# EAGLE schematic power electronics7 (EAGLE 9.2.2)
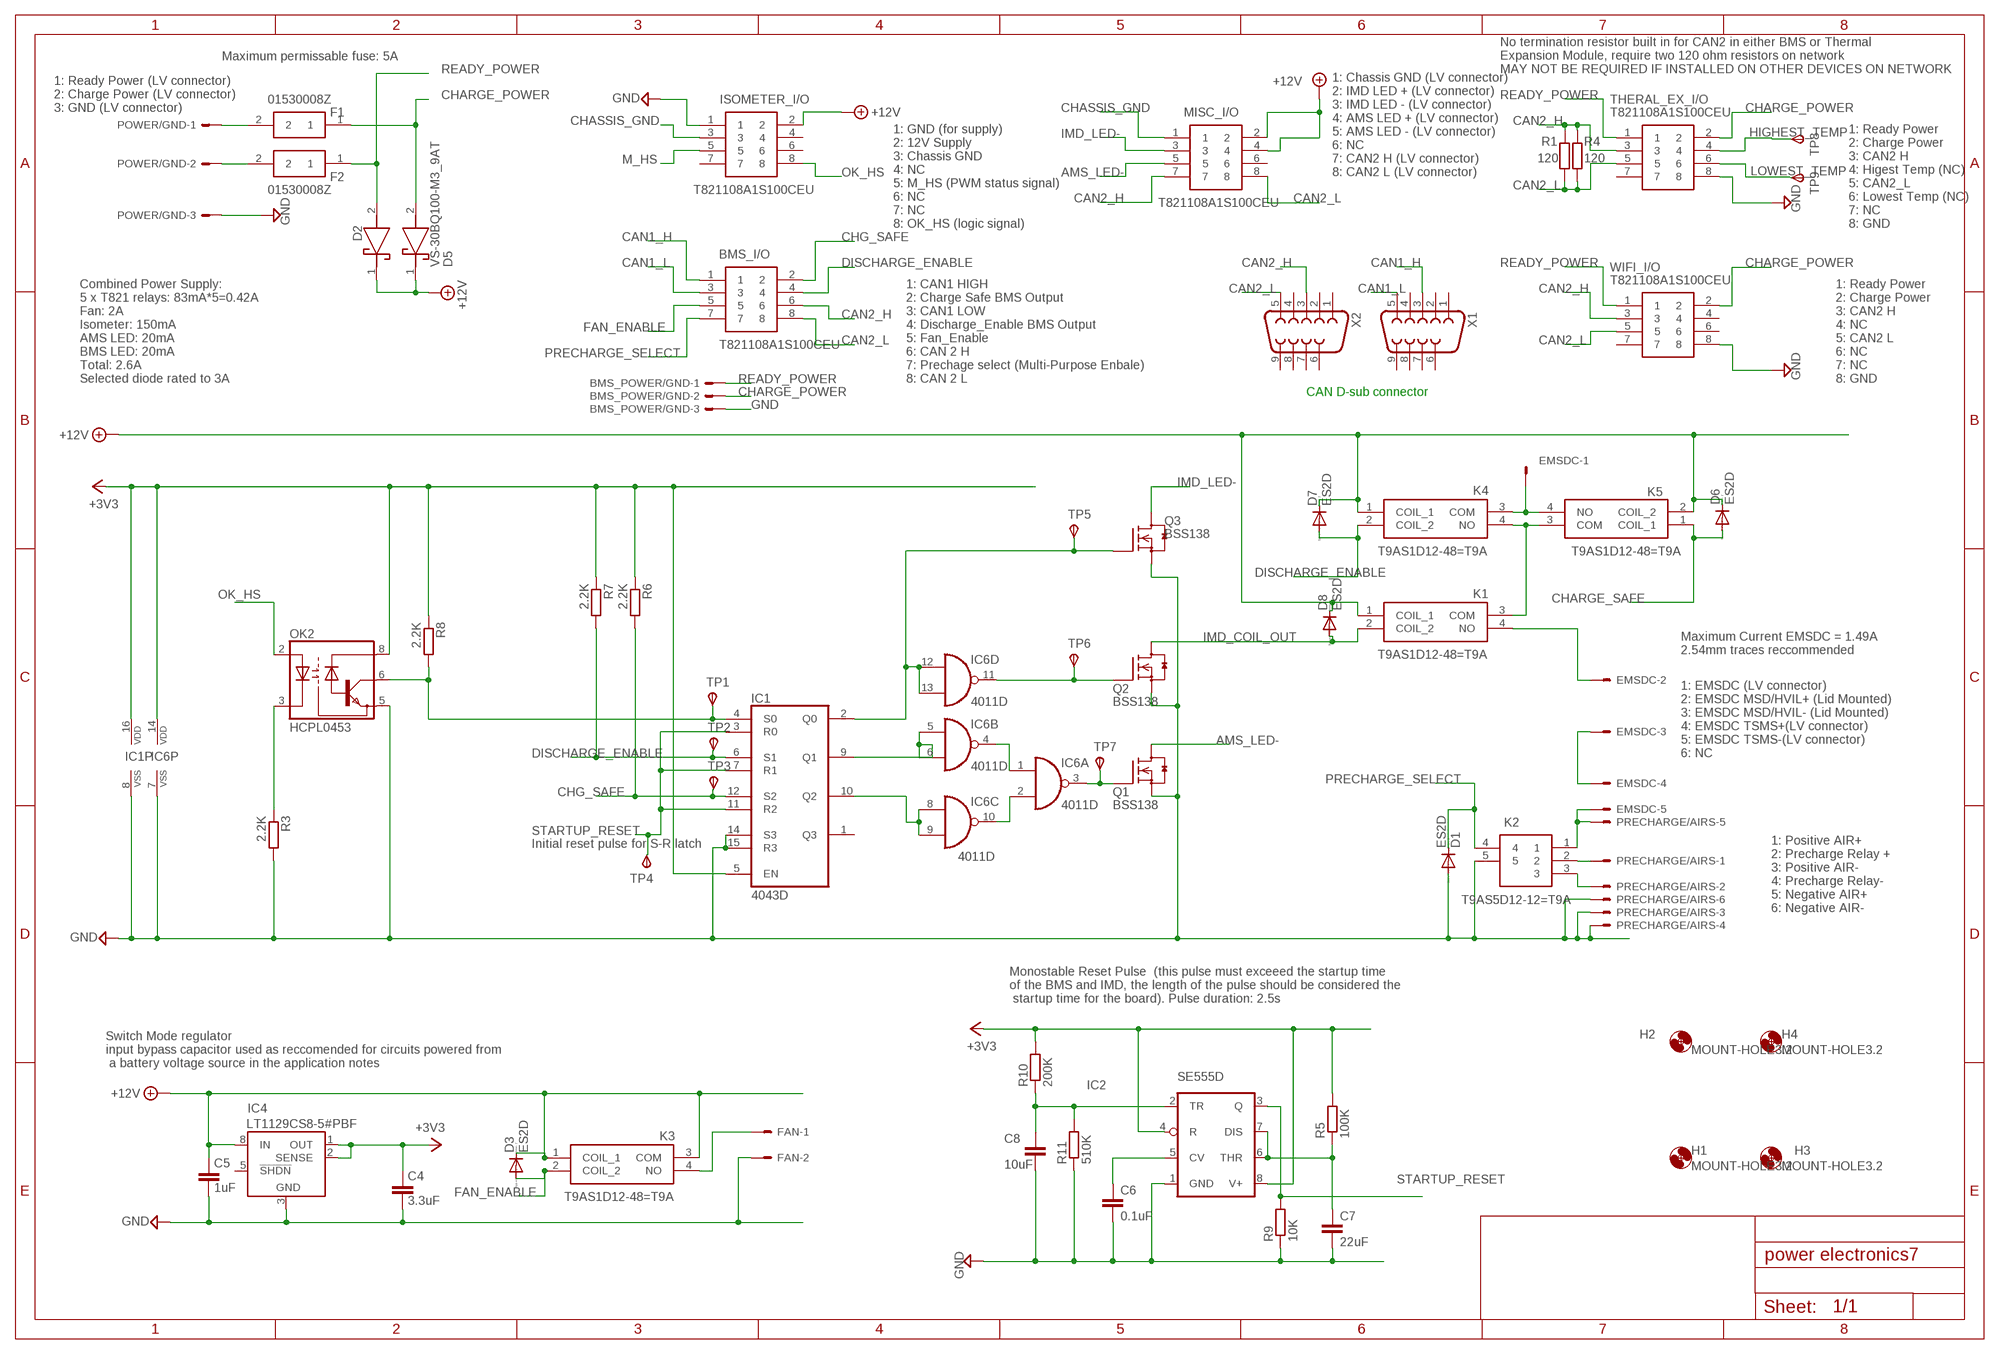
[diagram p0: schematic, sheet 1]

## Parts
BMS_I/O  T821108A1S100CEU  [HDRV8W64P254_2X4_1778X895X915P]
BMS_POWER/GND  KK-156-3  [KK-156-3]
C4  3.3uF  C-EUC1206  [C1206]
C5  1uF  C-EUC1206  [C1206]
C6  0.1uF  C-EUC1206  [C1206]
C7  22uF  C-EUC1206  [C1206]
C8  10uF  C-EUC1206  [C1206]
D1  ES2D  [SMB]
D2  VS-30BQ100-M3_9AT  [DIOM7959X262N]
D3  ES2D  [SMB]
D5  VS-30BQ100-M3_9AT  [DIOM7959X262N]
D6  ES2D  [SMB]
D7  ES2D  [SMB]
D8  ES2D  [SMB]
EMSDC  KK-156-6  [KK-156-6]
F1  01530008Z  [01530008]
F2  01530008Z  [01530008]
FAN  KK-156-2  [KK-156-2]
H1  MOUNT-HOLE3.2  [3,2]
H2  MOUNT-HOLE3.2  [3,2]
H3  MOUNT-HOLE3.2  [3,2]
H4  MOUNT-HOLE3.2  [3,2]
IC1  4043D  [SO16]
IC2  SE555D  [SO08]
IC4  LT1129CS8  [SOIC8]
IC6  4011D  [SO14]
ISOMETER_I/O  T821108A1S100CEU  [HDRV8W64P254_2X4_1778X895X915P]
K1  T9AS1D12-48=T9A  [T9AS1D1248T9A]
K2  T9AS5D12-12=T9A  [T9AS1D12]
K3  T9AS1D12-48=T9A  [T9AS1D1248T9A]
K4  T9AS1D12-48=T9A  [T9AS1D1248T9A]
K5  T9AS1D12-48=T9A  [T9AS1D1248T9A]
MISC_I/O  T821108A1S100CEU  [HDRV8W64P254_2X4_1778X895X915P]
OK2  HCPL0453  [SOIC08]
POWER/GND  KK-156-3  [KK-156-3]
PRECHARGE/AIRS  KK-156-6  [KK-156-6]
Q1  BSS138  [SOT23]
Q2  BSS138  [SOT23]
Q3  BSS138  [SOT23]
R1  120  R-EU_R1206  [R1206]
R3  2.2K  R-EU_R1206  [R1206]
R4  120  R-EU_R1206  [R1206]
R5  100K  R-EU_R1206  [R1206]
R6  2.2K  R-EU_R1206  [R1206]
R7  2.2K  R-EU_R1206  [R1206]
R8  2.2K  R-EU_R1206  [R1206]
R9  10K  R-EU_R1206  [R1206]
R10  200K  R-EU_R1206  [R1206]
R11  510K  R-EU_R1206  [R1206]
THERAL_EX_I/O  T821108A1S100CEU  [HDRV8W64P254_2X4_1778X895X915P]
TP1  TPSTP11R  [TP11R]
TP2  TPSTP11R  [TP11R]
TP3  TPSTP11R  [TP11R]
TP4  TPSTP11R  [TP11R]
TP5  TPSTP11R  [TP11R]
TP6  TPSTP11R  [TP11R]
TP7  TPSTP11R  [TP11R]
TP8  TPSTP11R  [TP11R]
TP9  TPSTP11R  [TP11R]
WIFI_I/O  T821108A1S100CEU  [HDRV8W64P254_2X4_1778X895X915P]
X1  F09V  [F09V]
X2  F09V  [F09V]

## Nets
+3V3: C4.1 IC1.5(EN) IC1.16(VDD) IC2.4(R) IC2.8(V+) IC4.1(OUT) IC4.2(SENSE) IC6.14(P:VDD) OK2.8(VCC) R5.2 R6.1 R7.1 R8.1 R10.2
+12V [power]: C5.1 D2.1(K) D3.C D5.1(K) D6.C D7.C D8.C IC4.8(IN) ISOMETER_I/O.2 K1.1(COIL_1) K3.1(COIL_1) K3.3(COM) K4.1(COIL_1) K5.2(COIL_2) MISC_I/O.2 MISC_I/O.4
AMS_LED-: MISC_I/O.5 Q1.3(D)
CAN1_H: BMS_I/O.1 X1.3
CAN1_L: BMS_I/O.3 X1.5
CAN2_H: BMS_I/O.6 MISC_I/O.7 R1.1 R4.1 THERAL_EX_I/O.3 WIFI_I/O.3 X2.3
CAN2_L: BMS_I/O.8 MISC_I/O.8 R1.2 R4.2 THERAL_EX_I/O.5 WIFI_I/O.5 X2.5
CHARGE_POWER [power]: BMS_POWER/GND.2 D5.2(A) F1.1 THERAL_EX_I/O.2 WIFI_I/O.2
CHARGE_SAFE: D6.A K5.1(COIL_1)
CHASSIS_GND [GND]: ISOMETER_I/O.3 MISC_I/O.1
CHG_SAFE: BMS_I/O.2 IC1.12(S2) R6.2 TP3.TP(PP)
DISCHARGE_ENABLE: BMS_I/O.4 D7.A IC1.6(S1) K4.2(COIL_2) R7.2 TP2.TP(PP)
EMSDC_IMD+ [EMSDC]: K1.3(COM) K4.4(NO) K5.3(COM)
FAN+ [power]: FAN.1 K3.4(NO)
FAN_ENABLE: BMS_I/O.5 D3.A K3.2(COIL_2)
GND [GND]: BMS_POWER/GND.3 C4.2 C5.2 C6.2 C7.2 C8.2 D1.A FAN.2 IC1.8(VSS) IC1.14(S3) IC1.15(R3) IC2.1(GND) IC4.3(GND) IC6.7(P:VSS) ISOMETER_I/O.1 K2.5 OK2.5(GND) POWER/GND.3 PRECHARGE/AIRS.3 PRECHARGE/AIRS.4 PRECHARGE/AIRS.6 Q1.2(S) Q2.2(S) Q3.2(S) R3.2 R9.1 R11.1 THERAL_EX_I/O.8 WIFI_I/O.8
HIGHEST_TEMP: THERAL_EX_I/O.4 TP8.TP(PP)
IMD_COIL_OUT: D8.A K1.2(COIL_2) Q2.3(D)
IMD_LED-: MISC_I/O.3 Q3.3(D)
LOWEST_TEMP: THERAL_EX_I/O.6 TP9.TP(PP)
M_HS: ISOMETER_I/O.5
N$1 [EMSDC]: EMSDC.1 K4.3(COM) K5.4(NO)
N$2 [power]: F2.2 POWER/GND.2
N$3 [EMSDC]: K2.2 PRECHARGE/AIRS.1
N$4 [power]: F1.2 POWER/GND.1
N$5: IC1.4(S0) OK2.6(VO) R8.2 TP1.TP(PP)
N$7: OK2.3(C) R3.1
N$8: IC1.2(Q0) IC6.12(D:I0) IC6.13(D:I1) Q3.1(G) TP5.TP(PP)
N$10: IC1.9(Q1) IC6.5(B:I0) IC6.6(B:I1)
N$11 [EMSDC]: EMSDC.5 K2.1 PRECHARGE/AIRS.5
N$12 [EMSDC]: K2.3 PRECHARGE/AIRS.2
N$13: IC1.10(Q2) IC6.8(C:I0) IC6.9(C:I1)
N$14: IC6.1(A:I0) IC6.4(B:O)
N$15 [EMSDC]: EMSDC.2 K1.4(NO)
N$17: C7.1 IC2.6(THR) IC2.7(DIS) R5.1
N$19 [EMSDC]: EMSDC.3 EMSDC.4
N$20: IC6.2(A:I1) IC6.10(C:O)
N$21: IC6.3(A:O) Q1.1(G) TP7.TP(PP)
N$28: C8.1 IC2.2(TR) R10.1 R11.2
N$32: C6.1 IC2.5(CV)
N$37: IC6.11(D:O) Q2.1(G) TP6.TP(PP)
OK_HS: ISOMETER_I/O.8 OK2.2(A)
PRECHARGE_SELECT: BMS_I/O.7 D1.C K2.4
READY_POWER [power]: BMS_POWER/GND.1 D2.2(A) F2.1 THERAL_EX_I/O.1 WIFI_I/O.1
STARTUP_RESET: IC1.3(R0) IC1.7(R1) IC1.11(R2) IC2.3(Q) R9.2 TP4.TP(PP)
Unconnected: EMSDC.6 IC1.1(Q3) IC4.4(NC) IC4.5(!SHDN) ISOMETER_I/O.4 ISOMETER_I/O.6 ISOMETER_I/O.7 MISC_I/O.6 THERAL_EX_I/O.7 WIFI_I/O.4 WIFI_I/O.6 WIFI_I/O.7 X1.1 X1.2 X1.4 X1.6 X1.7 X1.8 X1.9 X2.1 X2.2 X2.4 X2.6 X2.7 X2.8 X2.9

## Notes on the sheet
- Maximum permissable fuse: 5A
- No termination resistor built in for CAN2 in either BMS or Thermal
  Expansion Module, require two 120 ohm resistors on network
  MAY NOT BE REQUIRED IF INSTALLED ON OTHER DEVICES ON NETWORK
- 1: Ready Power (LV connector)
  2: Charge Power (LV connector)
  3: GND (LV connector)
- 1: Chassis GND (LV connector)
  2: IMD LED + (LV connector)
  3: IMD LED - (LV connector)
  4: AMS LED + (LV connector)
  5: AMS LED - (LV connector)
  6: NC
  7: CAN2 H (LV connector)
  8: CAN2 L (LV connector)
- 1: GND (for supply) 
  2: 12V Supply
  3: Chassis GND 
  4: NC 
  5: M_HS (PWM status signal)
  6: NC
  7: NC
  8: OK_HS (logic signal)
- 1: Ready Power
  2: Charge Power
  3: CAN2 H
  4: Higest Temp (NC)
  5: CAN2_L
  6: Lowest Temp (NC)
  7: NC
  8: GND
- Combined Power Supply:
  5 x T821 relays: 83mA*5=0.42A
  Fan: 2A
  Isometer: 150mA
  AMS LED: 20mA
  BMS LED: 20mA
  Total: 2.6A
  Selected diode rated to 3A
- 1: CAN1 HIGH
  2: Charge Safe BMS Output 
  3: CAN1 LOW
  4: Discharge_Enable BMS Output
  5: Fan_Enable
  6: CAN 2 H
  7: Prechage select (Multi-Purpose Enbale)
  8: CAN 2 L
- 1: Ready Power
  2: Charge Power
  3: CAN2 H
  4: NC
  5: CAN2 L
  6: NC
  7: NC
  8: GND
- CAN D-sub connector
- Maximum Current EMSDC = 1.49A
  2.54mm traces reccommended
- 1: EMSDC (LV connector)
  2: EMSDC MSD/HVIL+ (Lid Mounted)
  3: EMSDC MSD/HVIL- (Lid Mounted)
  4: EMSDC TSMS+(LV connector)
  5: EMSDC TSMS-(LV connector)
  6: NC
- Initial reset pulse for S-R latch
- 1: Positive AIR+
  2: Precharge Relay +
  3: Positive AIR-
  4: Precharge Relay-
  5: Negative AIR+
  6: Negative AIR-
- Monostable Reset Pulse  (this pulse must exceeed the startup time 
  of the BMS and IMD, the length of the pulse should be considered the
   startup time for the board). Pulse duration: 2.5s
- Switch Mode regulator
  input bypass capacitor used as reccomended for circuits powered from
   a battery voltage source in the application notes

## Power pins joined to a net without a drawn wire
GND: IC4.6(GND) IC4.7(GND)

## Library data of the parts
BMS_I/O ISOMETER_I/O MISC_I/O THERAL_EX_I/O WIFI_I/O = SamacSys_Parts:T821108A1S100CEU: HEADER, VERTICAL, 2.54MM, 8WAY Amphenol T821 Series, 2.54mm Pitch 8 Way 2 Row Straight PCB Header, Solder Termination, 3A Source: Datasheet <http://uk.rs-online.com/web/p/products/8323569>; DESCRIPTION: HEADER, VERTICAL, 2.54MM, 8WAY Amphenol T821 Series, 2.54mm Pitch 8 Way 2 Row Straight PCB Header, Solder Termination, 3A; HEIGHT: 9.15mm; MANUFACTURER_NAME: Amphenol; MANUFACTURER_PART_NUMBER: T821108A1S100CEU; RS_PART_NUMBER: 8323569; RS_PRICE-STOCK: http://uk.rs-online.com/web/p/products/8323569
BMS_POWER/GND POWER/GND = con-molex:KK-156-3: KK 156 HEADER Source: http://www.molex.com/pdm_docs/sd/026604100_sd.pdf; MF: MOLEX; OC_FARNELL: unknown; OC_NEWARK: unknown
C4-C8 = rcl:C-EU: CAPACITOR, European symbol; SPICEPREFIX: C
D1 D3 D6-D8 = diode:ES2D: DIODE super fast rectifier, 2 A
D2 D5 = SamacSys_Parts:VS-30BQ100-M3_9AT: Vishay VS-30BQ100-M3/9AT SMT Schottky Diode, 100V 3A, 2-Pin DO-214AB Source: Datasheet <https://componentsearchengine.com/Datasheets/1/VS-30BQ100-M3_9AT.pdf>; DESCRIPTION: Vishay VS-30BQ100-M3/9AT SMT Schottky Diode, 100V 3A, 2-Pin DO-214AB; HEIGHT: 2.62mm; MANUFACTURER_NAME: Vishay; MANUFACTURER_PART_NUMBER: VS-30BQ100-M3/9AT; MOUSER_PART_NUMBER: 78-VS-30BQ100-M39AT; MOUSER_PRICE-STOCK: https://www.mouser.com/Search/Refine.aspx?Keyword=78-VS-30BQ100-M39AT
EMSDC PRECHARGE/AIRS = con-molex:KK-156-6: KK 156 HEADER Source: http://www.molex.com/pdm_docs/sd/026604100_sd.pdf; MF: MOLEX; OC_FARNELL: unknown; OC_NEWARK: unknown
F1 F2 = SamacSys_Parts:01530008Z: Mini fuseholder,15A 32V Littelfuse 15A PCB Mount Fuse Holder Automotive Fuse, 32 V Source: Datasheet <http://www.littelfuse.com/data/en/data_sheets/153_pcmount.pdf>; ALLIED_NUMBER: 70184304; DESCRIPTION: Mini fuseholder,15A 32V Littelfuse 15A PCB Mount Fuse Holder Automotive Fuse, 32 V; HEIGHT: mm; MANUFACTURER_NAME: LITTELFUSE; MANUFACTURER_PART_NUMBER: 01530008Z; RS_PART_NUMBER: 3607317; RS_PRICE-STOCK: https://uk.rs-online.com/web/p/products/3607317
FAN = con-molex:KK-156-2: KK 156 HEADER Source: http://www.molex.com/pdm_docs/sd/026604100_sd.pdf; MF: MOLEX; OC_FARNELL: unknown; OC_NEWARK: unknown
H1-H4 = holes:MOUNT-HOLE: MOUNTING HOLE with drill center marker
IC1 = 40xx:4043: Quad 3-state NOR R/S LATCH
IC2 = linear:*555: TIMER
IC4 = linear-technology:LT1129CS8: VOLTAGE REGULATOR with shutdown; MPN: LT1129CS8-5#PBF; OC_FARNELL: 1273576; OC_NEWARK: 57M2078
IC6 = 40xx:4011: Quad 2-input NAND
K1 K3-K5 = SamacSys_Parts:T9AS1D12-48=T9A: SPST-NO PCB Mount Non-Latching Relay Through Hole, 48V dc Source: Datasheet <http://uk.rs-online.com/web/p/products/6802534P>; DESCRIPTION: SPST-NO PCB Mount Non-Latching Relay Through Hole, 48V dc; HEIGHT: 20.4mm; MANUFACTURER_NAME: TE Connectivity; MANUFACTURER_PART_NUMBER: T9AS1D12-48=T9A; RS_PART_NUMBER: 6802534P; RS_PRICE-STOCK: http://uk.rs-online.com/web/p/products/6802534P
K2 = SamacSys_Parts:T9AS5D12-12=T9A: PCB Relay SPDT 30A 12Vdc,thru hole SPDT PCB Mount Non-Latching Relay Through Hole, 12V dc Source: Datasheet; ALLIED_NUMBER: R1111589; DESCRIPTION: PCB Relay SPDT 30A 12Vdc,thru hole SPDT PCB Mount Non-Latching Relay Through Hole, 12V dc; HEIGHT: mm; MANUFACTURER_NAME: TE Connectivity; MANUFACTURER_PART_NUMBER: T9AS5D12-12=T9A; RS_PART_NUMBER: 6802528; RS_PRICE-STOCK: https://uk.rs-online.com/web/p/products/6802528
OK2 = optocoupler:HCPL0453: HEWLETT PACKARD OPTO COUPLER; MF: AGILENT TECHNOLOGIES; MPN: HCPL-0453-000E; OC_FARNELL: 1505123; OC_NEWARK: 88H7766
Q1-Q3 = m-pad-2.1:BSS138: Fairchild Semiconductors BSS138 N-Channel Logic Level Enhancement Mode Field Effect Transistor General Description: These N-Channel enhancement mode field effect transistors are produced using Fairchild's proprietary, high cell density, DMOS technology. These products have been designed to minimize on-state resistance while provide rugged, reliable, and fast switching performance.These products are particularly suited for low voltage, low current applications such as small servo motor control, power MOSFET gate drivers, and other switching applications. Features: 0.22 A, 50 V. RDS(ON) = 3.5Ohm @ VGS = 10 V RDS(ON) = 6.0Ohm @ VGS = 4.5 V High density cell design for extremely low RDS(ON) Rugged and Reliable Compact industry standard SOT-23 surface mount package Please send any comments to: messi@users.sourceforge.net
R1 R3-R11 = rcl:R-EU_: RESISTOR, European symbol; SPICEPREFIX: R
TP1-TP9 = testpad:TPS: TEST PIN
X1 X2 = con-subd:F09: SUB-D; OC_FARNELL: unknown; OC_NEWARK: unknown

## Net classes
0 default: width 0.508 mm
1 GND: width 0.889 mm
2 EMSDC: width 2.54 mm
3 power: width 0.889 mm